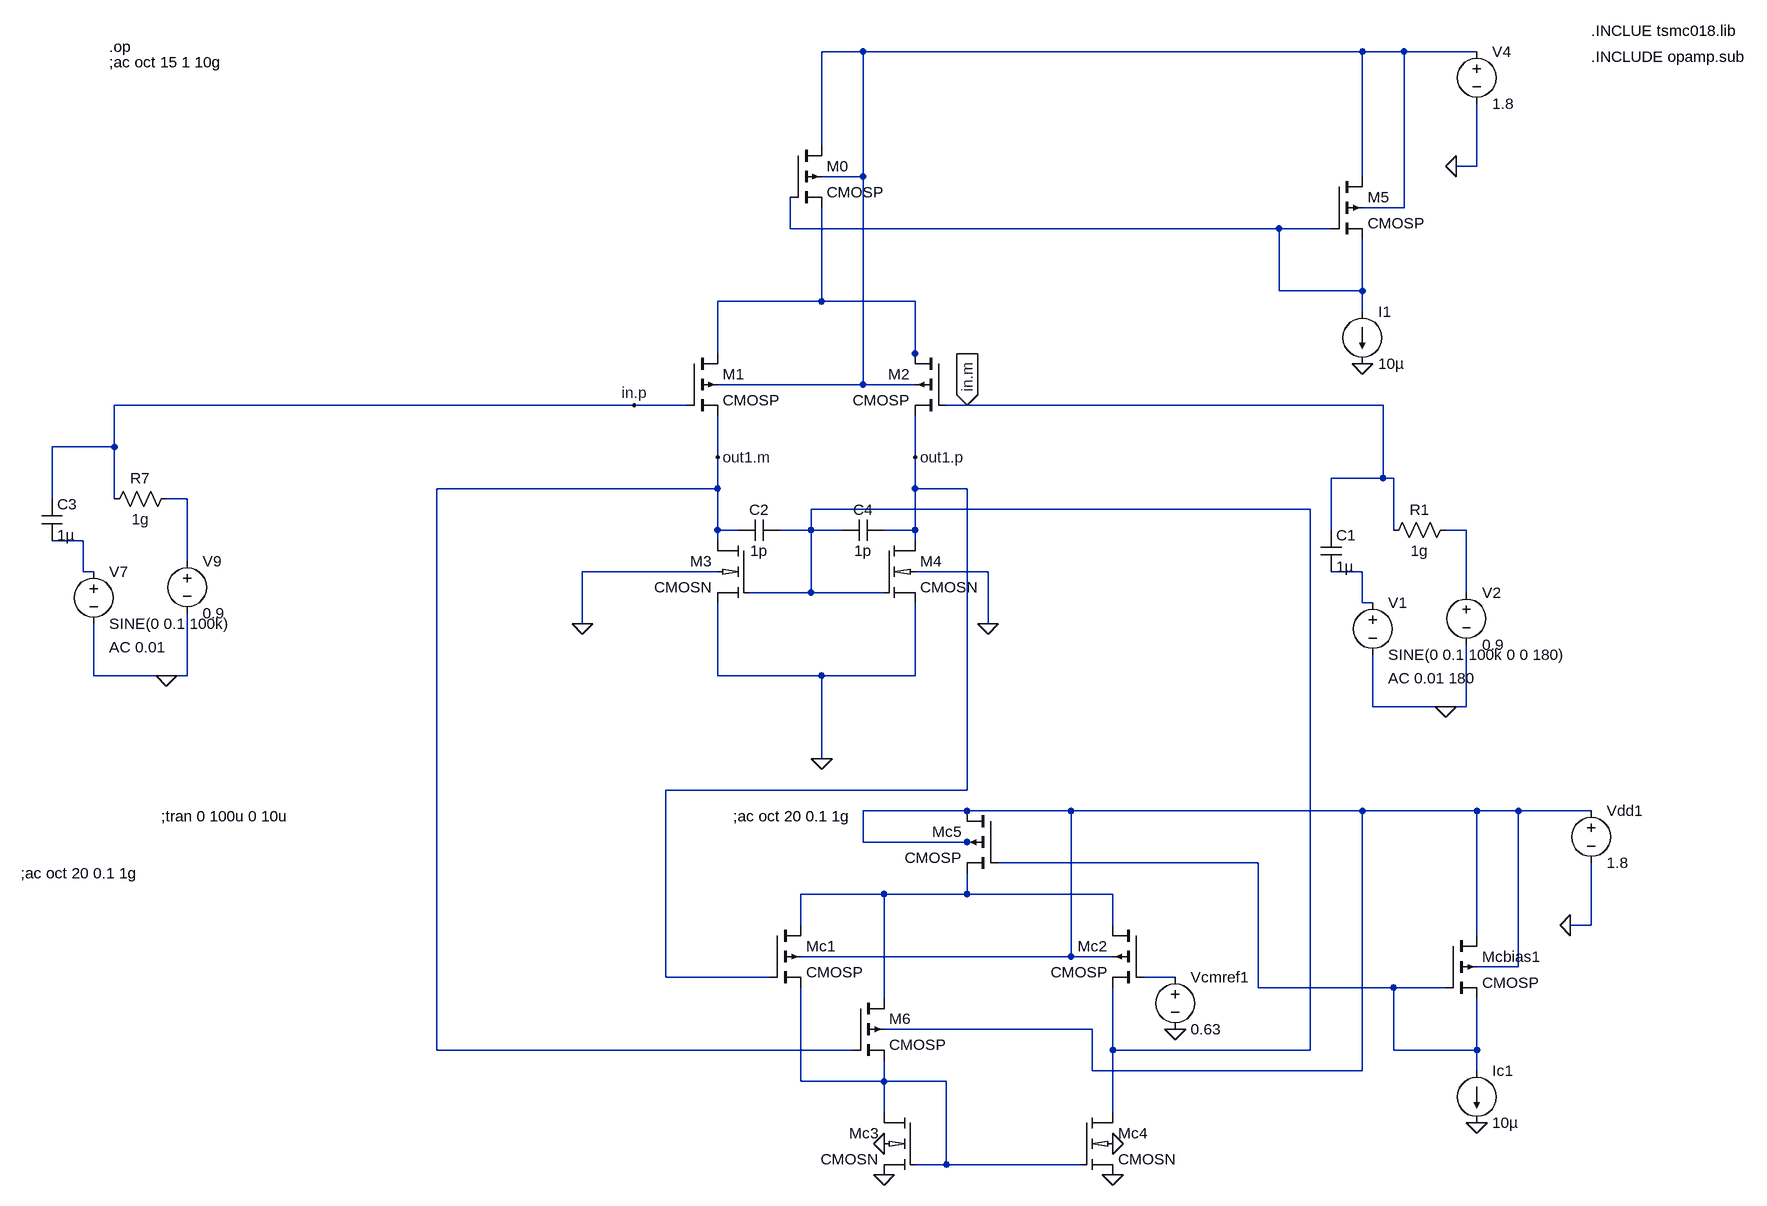
[diagram p0: schematic single_stage_diff_and_cmfb1.asc]
single_stage_diff_and_cmfb1.asc, the LTspice schematic file:
Version 4
SHEET 1 1436 1204
WIRE 48 -544 -16 -544
WIRE 816 -544 48 -544
WIRE 880 -544 816 -544
WIRE 992 -544 880 -544
WIRE -16 -400 -16 -544
WIRE 992 -368 992 -464
WIRE 992 -368 960 -368
WIRE 48 -352 48 -544
WIRE 48 -352 -16 -352
WIRE 816 -352 816 -544
WIRE 880 -304 880 -544
WIRE 880 -304 816 -304
WIRE -64 -272 -64 -320
WIRE 688 -272 -64 -272
WIRE 768 -272 688 -272
WIRE 688 -176 688 -272
WIRE 816 -176 816 -256
WIRE 816 -176 688 -176
WIRE -16 -160 -16 -304
WIRE -16 -160 -176 -160
WIRE 128 -160 -16 -160
WIRE 816 -144 816 -176
WIRE -176 -80 -176 -160
WIRE 128 -80 128 -160
WIRE 128 -64 128 -80
WIRE 48 -32 48 -352
WIRE 48 -32 -176 -32
WIRE 128 -32 48 -32
WIRE -304 0 -1104 0
WIRE -224 0 -304 0
WIRE 208 0 176 0
WIRE 848 0 208 0
WIRE -1104 64 -1104 0
WIRE -1104 64 -1200 64
WIRE -176 80 -176 16
WIRE 128 80 128 16
WIRE 848 112 848 0
WIRE 848 112 768 112
WIRE 864 112 848 112
WIRE -176 128 -176 80
WIRE -176 128 -608 128
WIRE 128 128 128 80
WIRE 208 128 128 128
WIRE -1200 144 -1200 64
WIRE -1104 144 -1104 64
WIRE -992 144 -1024 144
WIRE 736 160 -32 160
WIRE -176 192 -176 128
WIRE -144 192 -176 192
WIRE -32 192 -32 160
WIRE -32 192 -80 192
WIRE 16 192 -32 192
WIRE 128 192 128 128
WIRE 128 192 80 192
WIRE 768 192 768 112
WIRE 864 192 864 112
WIRE 976 192 944 192
WIRE -1152 208 -1200 208
WIRE -176 208 -176 192
WIRE 128 208 128 192
WIRE -992 240 -992 144
WIRE -1152 256 -1152 208
WIRE -1136 256 -1152 256
WIRE -176 256 -384 256
WIRE 240 256 128 256
WIRE 816 256 768 256
WIRE -32 288 -32 192
WIRE -32 288 -128 288
WIRE 80 288 -32 288
WIRE 976 288 976 192
WIRE 816 304 816 256
WIRE 832 304 816 304
WIRE -384 336 -384 256
WIRE 240 336 240 256
WIRE -1136 416 -1136 336
WIRE -1024 416 -1136 416
WIRE -992 416 -992 320
WIRE -992 416 -1024 416
WIRE -176 416 -176 304
WIRE -16 416 -176 416
WIRE 128 416 128 304
WIRE 128 416 -16 416
WIRE 832 464 832 384
WIRE 944 464 832 464
WIRE 976 464 976 368
WIRE 976 464 944 464
WIRE -16 544 -16 416
WIRE 208 592 208 128
WIRE 208 592 -256 592
WIRE 208 624 48 624
WIRE 368 624 208 624
WIRE 816 624 368 624
WIRE 992 624 816 624
WIRE 1056 624 992 624
WIRE 1168 624 1056 624
WIRE 48 672 48 624
WIRE 208 672 48 672
WIRE 224 672 208 672
WIRE 656 704 256 704
WIRE 80 752 -48 752
WIRE 208 752 208 720
WIRE 208 752 80 752
WIRE 432 752 208 752
WIRE -48 800 -48 752
WIRE 432 800 432 752
WIRE 1168 800 1168 704
WIRE 1168 800 1136 800
WIRE 992 816 992 624
WIRE 368 848 368 624
WIRE 368 848 -48 848
WIRE 432 848 368 848
WIRE 1056 864 1056 624
WIRE 1056 864 992 864
WIRE -256 880 -256 592
WIRE -96 880 -256 880
WIRE 528 880 480 880
WIRE 656 896 656 704
WIRE 864 896 656 896
WIRE 944 896 864 896
WIRE 80 912 80 752
WIRE 400 960 80 960
WIRE -608 992 -608 128
WIRE 32 992 -608 992
WIRE 432 992 432 896
WIRE 736 992 736 160
WIRE 736 992 432 992
WIRE 864 992 864 896
WIRE 992 992 992 912
WIRE 992 992 864 992
WIRE 400 1024 400 960
WIRE 816 1024 816 624
WIRE 816 1024 400 1024
WIRE 992 1024 992 992
WIRE -48 1040 -48 896
WIRE 80 1040 80 1008
WIRE 80 1040 -48 1040
WIRE 176 1040 80 1040
WIRE 80 1088 80 1040
WIRE 432 1088 432 992
WIRE 176 1168 176 1040
WIRE 176 1168 128 1168
WIRE 384 1168 176 1168
FLAG -16 544 0
FLAG 208 0 in.m
IOPIN 208 0 In
FLAG -304 0 in.p
FLAG -176 80 out1.m
FLAG 128 80 out1.p
FLAG -1024 416 0
FLAG 816 -64 0
FLAG 944 464 0
FLAG 960 -368 0
FLAG -384 336 0
FLAG 240 336 0
FLAG 992 1104 0
FLAG 1136 800 0
FLAG 432 1184 0
FLAG 80 1184 0
FLAG 528 960 0
FLAG 80 1136 0
FLAG 432 1136 0
SYMBOL cmosn -128 208 M0
SYMATTR InstName M3
SYMATTR Value2 l=0.24u w=2u
SYMBOL cmosp -224 -80 R0
SYMATTR InstName M1
SYMATTR Value2 l=0.24u w=32u
SYMBOL cmosp -64 -400 R0
SYMATTR InstName M0
SYMATTR Value2 l=0.24u w=64u
SYMBOL cmosp 176 -80 M0
SYMATTR InstName M2
SYMATTR Value2 l=0.24u w=32u
SYMBOL cmosn 80 208 R0
SYMATTR InstName M4
SYMATTR Value2 l=0.24u w=2u
SYMBOL voltage -1136 240 R0
WINDOW 123 24 132 Left 0
WINDOW 39 0 0 Left 0
SYMATTR Value2 AC 0.01
SYMATTR InstName V7
SYMATTR Value SINE(0 0.1 100k)
SYMBOL voltage -992 224 R0
WINDOW 123 0 0 Left 0
WINDOW 39 0 0 Left 0
SYMATTR InstName V9
SYMATTR Value 0.9
SYMBOL res -1008 128 R90
WINDOW 0 0 56 VBottom 0
WINDOW 3 32 56 VTop 0
SYMATTR InstName R7
SYMATTR Value 1g
SYMBOL cap -1216 144 R0
SYMATTR InstName C3
SYMATTR Value 1µ
SYMBOL cmosp 768 -352 R0
SYMATTR InstName M5
SYMATTR Value2 l=0.24u w=6.4u
SYMBOL current 816 -144 R0
WINDOW 123 0 0 Left 0
WINDOW 39 0 0 Left 0
SYMATTR InstName I1
SYMATTR Value 10µ
SYMBOL voltage 832 288 R0
WINDOW 123 24 132 Left 0
WINDOW 39 0 0 Left 0
SYMATTR Value2 AC 0.01 180
SYMATTR InstName V1
SYMATTR Value SINE(0 0.1 100k 0 0 180)
SYMBOL voltage 976 272 R0
WINDOW 123 0 0 Left 0
WINDOW 39 0 0 Left 0
SYMATTR InstName V2
SYMATTR Value 0.9
SYMBOL res 960 176 R90
WINDOW 0 0 56 VBottom 0
WINDOW 3 32 56 VTop 0
SYMATTR InstName R1
SYMATTR Value 1g
SYMBOL cap 752 192 R0
SYMATTR InstName C1
SYMATTR Value 1µ
SYMBOL voltage 992 -560 R0
WINDOW 123 0 0 Left 0
WINDOW 39 0 0 Left 0
SYMATTR InstName V4
SYMATTR Value 1.8
SYMBOL cap -80 176 R90
WINDOW 0 0 32 VBottom 0
WINDOW 3 32 32 VTop 0
SYMATTR InstName C2
SYMATTR Value 1p
SYMBOL cap 80 176 R90
WINDOW 0 0 32 VBottom 0
WINDOW 3 32 32 VTop 0
SYMATTR InstName C4
SYMATTR Value 1p
SYMBOL cmosp 944 816 R0
SYMATTR InstName Mcbias1
SYMATTR Value2 l=0.24u w=6.4u
SYMBOL current 992 1024 R0
WINDOW 123 0 0 Left 0
WINDOW 39 0 0 Left 0
SYMATTR InstName Ic1
SYMATTR Value 10µ
SYMBOL voltage 1168 608 R0
WINDOW 123 0 0 Left 0
WINDOW 39 0 0 Left 0
SYMATTR InstName Vdd1
SYMATTR Value 1.8
SYMBOL cmosp -96 800 R0
SYMATTR InstName Mc1
SYMATTR Value2 l=0.24u w=3.2u
SYMBOL cmosp 32 912 R0
SYMATTR InstName M6
SYMATTR Value2 l=0.24u w=3.2u
SYMBOL cmosp 480 800 M0
SYMATTR InstName Mc2
SYMATTR Value2 l=0.24u w=6.4u
SYMBOL cmosn 128 1088 M0
SYMATTR InstName Mc3
SYMATTR Value2 l=0.24u w=0.4u
SYMBOL cmosn 384 1088 R0
SYMATTR InstName Mc4
SYMATTR Value2 l=0.24u w=0.4u
SYMBOL cmosp 256 624 M0
SYMATTR InstName Mc5
SYMATTR Value2 l=0.24u w=12.8u
SYMBOL voltage 528 864 R0
WINDOW 123 0 0 Left 0
WINDOW 39 0 0 Left 0
SYMATTR InstName Vcmref1
SYMATTR Value 0.63
TEXT 1168 -576 Left 0 !.INCLUE tsmc018.lib
TEXT 1168 -536 Left 0 !.INCLUDE opamp.sub
TEXT -1248 720 Left 0 !;ac oct 20 0.1 1g
TEXT -1032 632 Left 0 !;tran 0 100u 0 10u
TEXT -1112 -552 Left 0 !.op
TEXT -152 632 Left 0 !;ac oct 20 0.1 1g
TEXT -1112 -528 Left 0 !;ac oct 15 1 10g

The netlist it stands for:
* single_stage_diff_and_cmfb1.asc
M3 out1.m N005 0 0 CMOSN l=0.24u w=2u
M1 N003 in.p out1.m N001 CMOSP l=0.24u w=32u
M0 N001 N002 N003 N001 CMOSP l=0.24u w=64u
M2 N003 in.m out1.p N001 CMOSP l=0.24u w=32u
M4 out1.p N005 0 0 CMOSN l=0.24u w=2u
V7 N007 0 SINE(0 0.1 100k) AC 0.01
V9 N004 0 0.9
R7 N004 in.p 1g
C3 in.p N007 1µ
M5 N001 N002 N002 N001 CMOSP l=0.24u w=6.4u
I1 N002 0 10µ
V1 N008 0 SINE(0 0.1 100k 0 0 180) AC 0.01 180
V2 N006 0 0.9
R1 N006 in.m 1g
C1 in.m N008 1µ
V4 N001 0 1.8
C2 N005 out1.m 1p
C4 out1.p N005 1p
Mcbias1 N009 N010 N010 N009 CMOSP l=0.24u w=6.4u
Ic1 N010 0 10µ
Vdd1 N009 0 1.8
Mc1 N011 out1.p N013 N009 CMOSP l=0.24u w=3.2u
M6 N011 out1.m N013 N009 CMOSP l=0.24u w=3.2u
Mc2 N011 N012 N005 N009 CMOSP l=0.24u w=6.4u
Mc3 N013 N013 0 0 CMOSN l=0.24u w=0.4u
Mc4 N005 N013 0 0 CMOSN l=0.24u w=0.4u
Mc5 N009 N010 N011 N009 CMOSP l=0.24u w=12.8u
Vcmref1 N012 0 0.63
.model NMOS NMOS
.model PMOS PMOS
.lib standard.mos
.INCLUE tsmc018.lib
.INCLUDE opamp.sub
;ac oct 20 0.1 1g
;tran 0 100u 0 10u
.op
;ac oct 20 0.1 1g
;ac oct 15 1 10g
.lib tsmc018.lib
.backanno
.end